# EAGLE schematic main_board-v2.1 (EAGLE 9.1.3)
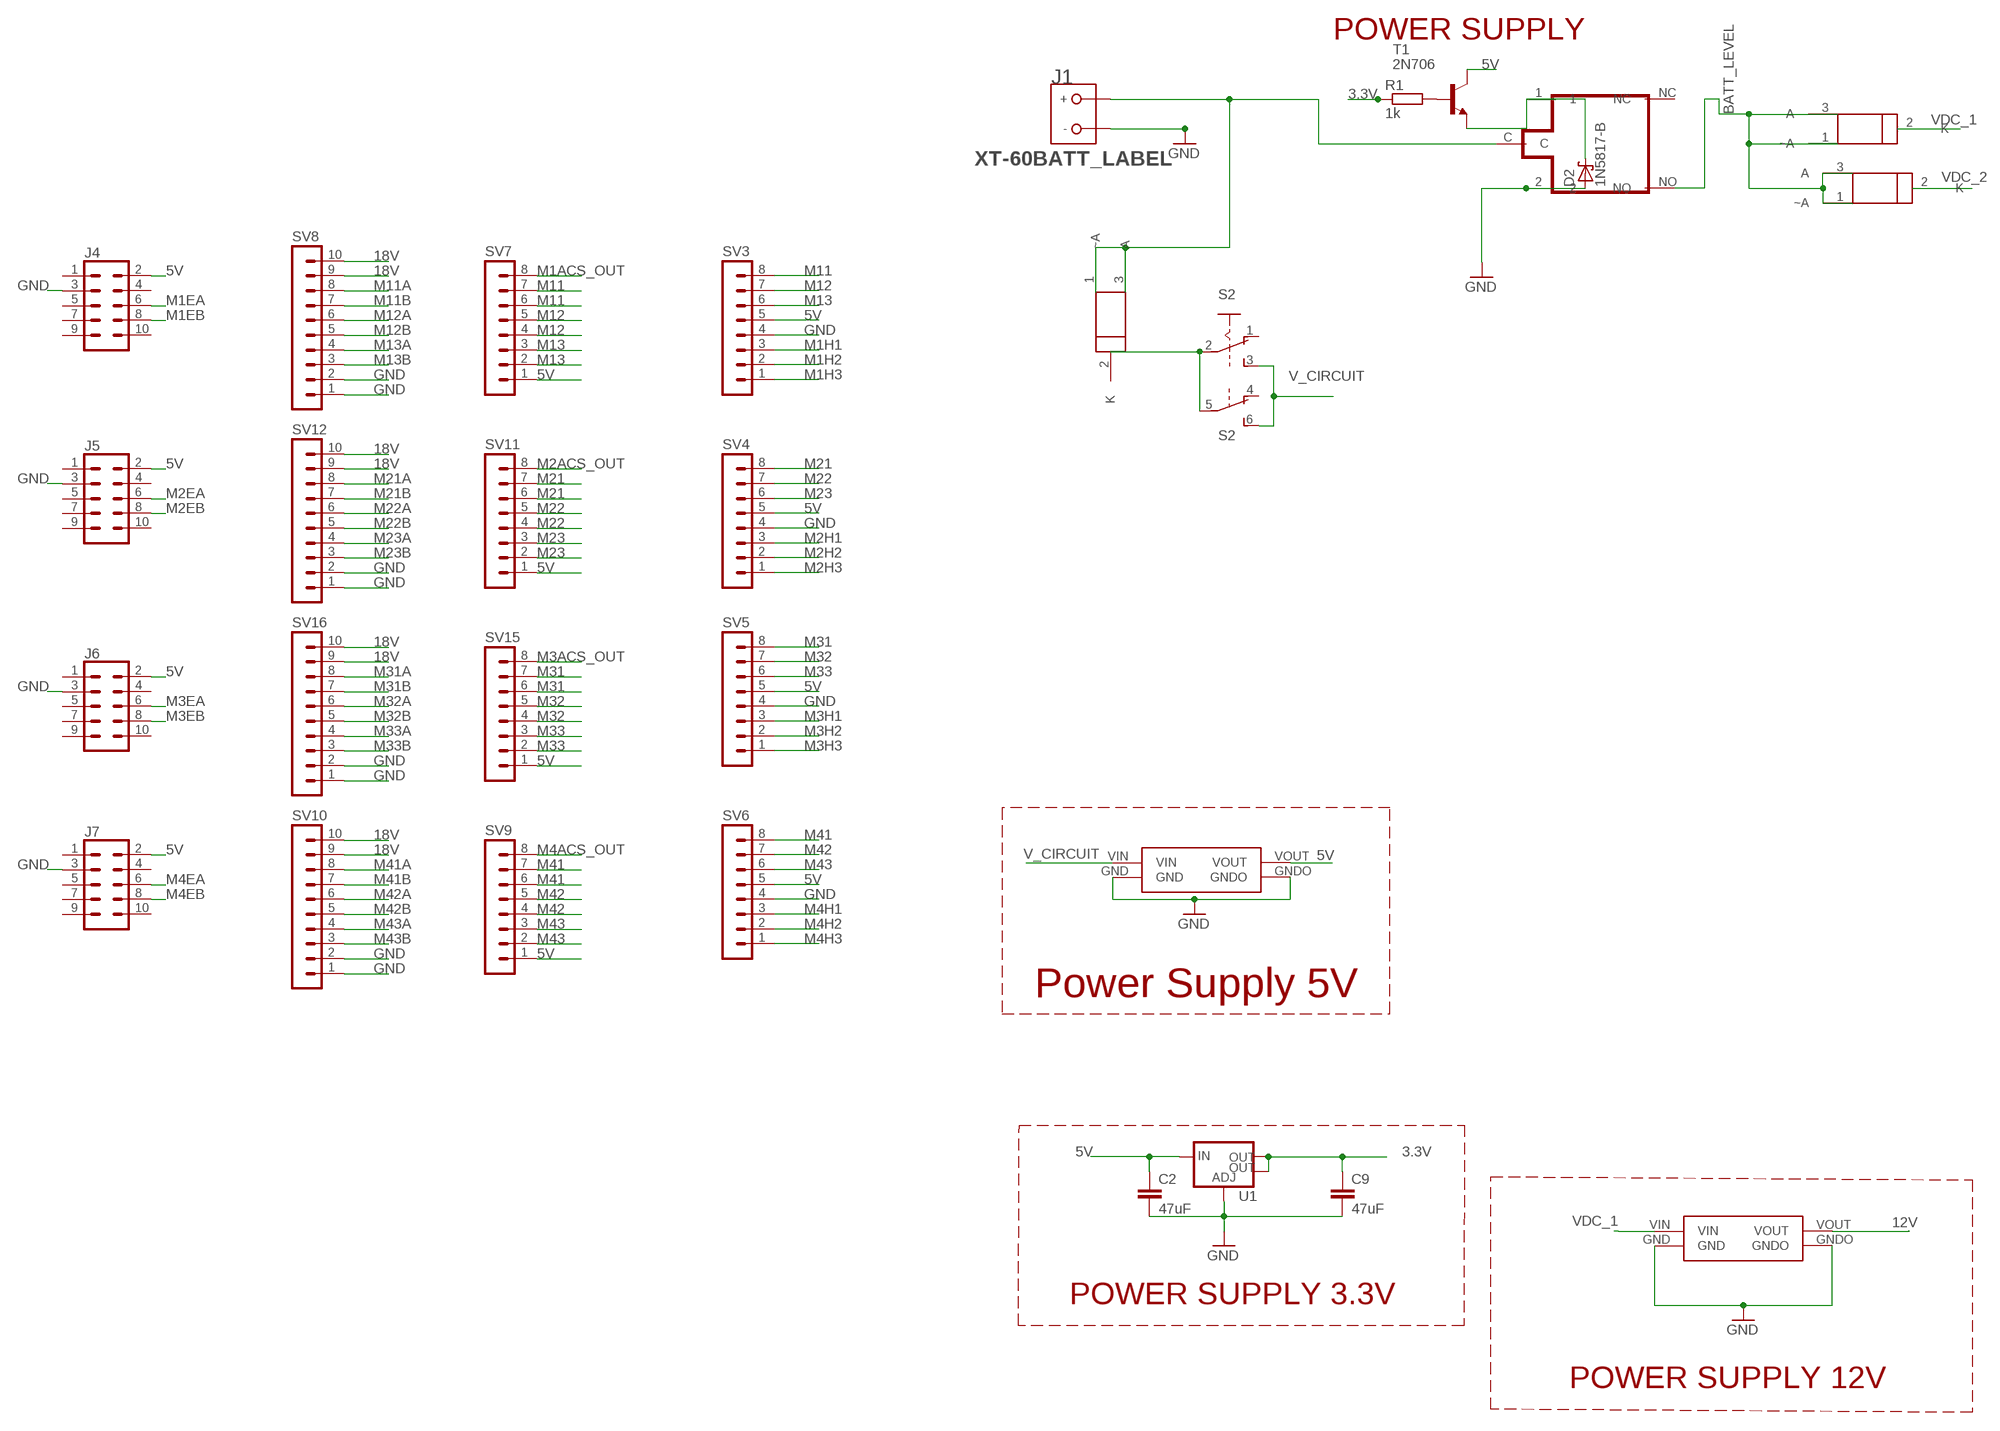
[diagram p0: schematic, sheet 1, part 1 of 2]
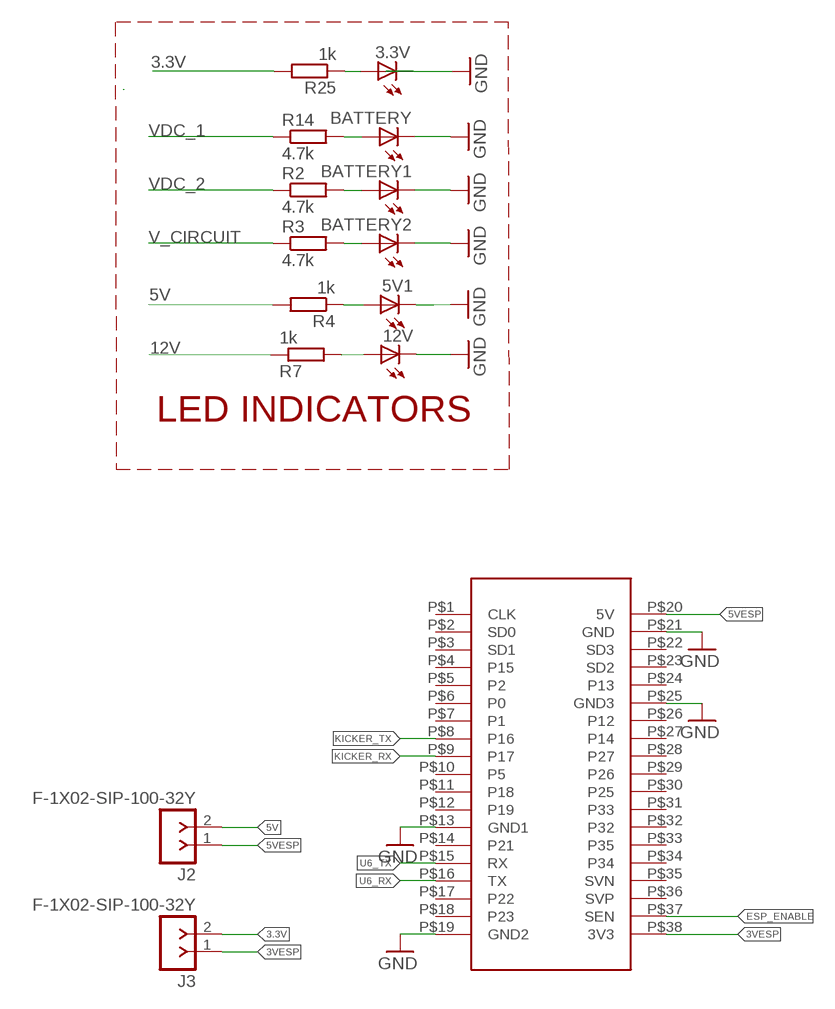
[diagram p1: schematic, sheet 1, part 2 of 2]

## Parts
3.3V  LEDCHIPLED_0805  [CHIPLED_0805]
5V1  LEDCHIPLED_0805  [CHIPLED_0805]
12V  LEDCHIPLED_0805  [CHIPLED_0805]
BATTERY  LEDCHIPLED_0805  [CHIPLED_0805]
BATTERY1  LEDCHIPLED_0805  [CHIPLED_0805]
BATTERY2  LEDCHIPLED_0805  [CHIPLED_0805]
C2  47uF  C-EUC1206  [C1206]
C9  47uF  C-EUC1206  [C1206]
D2  1N5817-B  [DO41-7.6]
J1  XT-60BATT_LABEL  [XT-60]
J2  F-1X02-SIP-100-32Y  [SIP-100-02-32Y]
J3  F-1X02-SIP-100-32Y  [SIP-100-02-32Y]
J4  CONN_05X2SHD_LOCK  [2X5-SHROUDED_LOCK]
J5  CONN_05X2SHD_LOCK  [2X5-SHROUDED_LOCK]
J6  CONN_05X2SHD_LOCK  [2X5-SHROUDED_LOCK]
J7  CONN_05X2SHD_LOCK  [2X5-SHROUDED_LOCK]
R1  1k  R-EU_R1206  [R1206]
R2  4.7k  R-EU_R1206  [R1206]
R3  4.7k  R-EU_R1206  [R1206]
R4  1k  R-EU_R1206  [R1206]
R7  1k  R-EU_R1206  [R1206]
R14  4.7k  R-EU_R1206  [R1206]
R25  1k  R-EU_R1206  [R1206]
S2  A68-A31  [A68-A31]
SV3  MA08-1  [MA08-1]
SV4  MA08-1  [MA08-1]
SV5  MA08-1  [MA08-1]
SV6  MA08-1  [MA08-1]
SV7  MA08-1  [MA08-1]
SV8  MA10-1  [MA10-1]
SV9  MA08-1  [MA08-1]
SV10  MA10-1  [MA10-1]
SV11  MA08-1  [MA08-1]
SV12  MA10-1  [MA10-1]
SV15  MA08-1  [MA08-1]
SV16  MA10-1  [MA10-1]
T1  2N706  [TO18]
U1  V_REG_LM1117SOT223  [SOT223]
U2  LP38690DT-3.3  [TO228P1042X238-3N]
U3  LP38690DT-3.3  [TO228P1042X238-3N]
U4  LP38690DT-3.3  [TO228P1042X238-3N]
U$2  REL  [REL]
U$3  BUCK  [BUCK]
U$4  BUCK  [BUCK]
U$6  NODEMCU32S  [NODEMCU32]

## Nets
3.3V: C9.1 J3.2 R1.1 R25.2 U1.2(OUT) U1.4(OUT)
3VESP: J3.1 U$6.P$38(3V3)
5V: C2.1 J2.2 J4.2 J5.2 J6.2 J7.2 R4.2 SV3.5 SV4.5 SV5.5 SV6.5 SV7.1 SV9.1 SV11.1 SV15.1 T1.3(C) U1.3(IN) U$3.VOUT
5VESP: J2.1 U$6.P$20(5V)
12V: R7.1 U$4.VOUT
18V [18V]: SV8.9 SV8.10 SV10.9 SV10.10 SV12.9 SV12.10 SV16.9 SV16.10
BATT_LEVEL: U2.1(~A) U2.3(A) U4.1(~A) U4.3(A) U$2.NO
ESP_ENABLE: U$6.P$37(SEN)
GND: 3.3V.C 5V1.C 12V.C BATTERY1.C BATTERY2.C BATTERY.C C2.2 C9.2 D2.A J1.GND(-) J4.3 J5.3 J6.3 J7.3 SV3.4 SV4.4 SV5.4 SV6.4 SV8.1 SV8.2 SV10.1 SV10.2 SV12.1 SV12.2 SV16.1 SV16.2 U1.1(ADJ) U$2.2 U$3.GND U$3.GNDO U$4.GND U$4.GNDO U$6.P$13(GND1) U$6.P$19(GND2) U$6.P$21(GND) U$6.P$25(GND3)
INPUT: J1.BATT(+) U3.1(~A) U3.3(A) U$2.C
KICKER_RX: U$6.P$9(P17)
KICKER_TX: U$6.P$8(P16)
M1ACS_OUT: SV7.8
M1EA: J4.6
M1EB: J4.8
M1H1: SV3.3
M1H2: SV3.2
M1H3: SV3.1
M2ACS_OUT: SV11.8
M2EA: J5.6
M2EB: J5.8
M2H1: SV4.3
M2H2: SV4.2
M2H3: SV4.1
M3ACS_OUT: SV15.8
M3EA: J6.6
M3EB: J6.8
M3H1: SV5.3
M3H2: SV5.2
M3H3: SV5.1
M4ACS_OUT: SV9.8
M4EA: J7.6
M4EB: J7.8
M4H1: SV6.3
M4H2: SV6.2
M4H3: SV6.1
M11: SV3.8 SV7.6 SV7.7
M11A [signal]: SV8.8
M11B [signal]: SV8.7
M12: SV3.7 SV7.4 SV7.5
M12A: SV8.6
M12B: SV8.5
M13: SV3.6 SV7.2 SV7.3
M13A: SV8.4
M13B: SV8.3
M21: SV4.8 SV11.6 SV11.7
M21A: SV12.8
M21B: SV12.7
M22: SV4.7 SV11.4 SV11.5
M22A: SV12.6
M22B: SV12.5
M23: SV4.6 SV11.2 SV11.3
M23A: SV12.4
M23B: SV12.3
M31 [motor]: SV5.8 SV15.6 SV15.7
M31A: SV16.8
M31B: SV16.7
M32 [motor]: SV5.7 SV15.4 SV15.5
M32A: SV16.6
M32B: SV16.5
M33 [motor]: SV5.6 SV15.2 SV15.3
M33A: SV16.4
M33B: SV16.3
M41: SV6.8 SV9.6 SV9.7
M41A: SV10.8
M41B: SV10.7
M42: SV6.7 SV9.4 SV9.5
M42A: SV10.6
M42B: SV10.5
M43: SV6.6 SV9.2 SV9.3
M43A: SV10.4
M43B: SV10.3
N$1: BATTERY1.A R2.2
N$2: BATTERY2.A R3.2
N$3: 5V1.A R4.1
N$14: 12V.A R7.2
N$18: BATTERY.A R14.2
N$19: 3.3V.A R25.1
N$21: R1.2 T1.2(B)
N$22: D2.C T1.1(E) U$2.1
N$25: S2.2(A:P) S2.5(B:P) U3.2(K)
U6_RX: U$6.P$16(TX)
U6_TX: U$6.P$15(RX)
V_CIRCUIT: R3.1 S2.3(A:S) S2.6(B:S) U$3.VIN
VDC_1: R14.1 U4.2(K) U$4.VIN
VDC_2: R2.1 U2.2(K)
Unconnected: J4.1 J4.4 J4.5 J4.7 J4.9 J4.10 J5.1 J5.4 J5.5 J5.7 J5.9 J5.10 J6.1 J6.4 J6.5 J6.7 J6.9 J6.10 J7.1 J7.4 J7.5 J7.7 J7.9 J7.10 S2.1(A:O) S2.4(B:O) U$2.NC U$6.P$1(CLK) U$6.P$2(SD0) U$6.P$3(SD1) U$6.P$4(P15) U$6.P$5(P2) U$6.P$6(P0) U$6.P$7(P1) U$6.P$10(P5) U$6.P$11(P18) U$6.P$12(P19) U$6.P$14(P21) U$6.P$17(P22) U$6.P$18(P23) U$6.P$22(SD3) U$6.P$23(SD2) U$6.P$24(P13) U$6.P$26(P12) U$6.P$27(P14) U$6.P$28(P27) U$6.P$29(P26) U$6.P$30(P25) U$6.P$31(P33) U$6.P$32(P32) U$6.P$33(P35) U$6.P$34(P34) U$6.P$35(SVN) U$6.P$36(SVP)

## Notes on the sheet
- POWER SUPPLY
- LED INDICATORS
- Power Supply 5V
- POWER SUPPLY 3.3V
- POWER SUPPLY 12V

## Library data of the parts
3.3V 5V1 12V BATTERY BATTERY1 BATTERY2 = led:LED: LED OSRAM: - CHIPLED LG R971, LG N971, LY N971, LG Q971, LY Q971, LO R971, LY R971 LH N974, LH R974 LS Q976, LO Q976, LY Q976 LO Q996 - Hyper CHIPLED LW Q18S LB Q993, LB Q99A, LB R99A - SideLED LS A670, LO A670, LY A670, LG A670, LP A670 LB A673, LV A673, LT A673, LW A673 LH A674 LY A675 LS A676, LA A676, LO A676, LY A676, LW A676 LS A679, LY A679, LG A679 - Hyper Micro SIDELED® LS Y876, LA Y876, LO Y876, LY Y876 LT Y87S - SmartLED LW L88C, LW L88S LB L89C, LB L89S, LG L890 LS L89K, LO L89K, LY L89K LS L896, LA L896, LO L896, LY L896 - TOPLED LS T670, LO T670, LY T670, LG T670, LP T670 LSG T670, LSP T670, LSY T670, LOP T670, LYG T670 LG T671, LOG T671, LSG T671 LB T673, LV T673, LT T673, LW T673 LH T674 LS T676, LA T676, LO T676, LY T676, LB T676, LH T676, LSB T676, LW T676 LB T67C, LV T67C, LT T67C, LS T67K, LO T67K, LY T67K, LW E67C LS E67B, LA E67B, LO E67B, LY E67B, LB E67C, LV E67C, LT E67C LW T67C LS T679, LY T679, LG T679 LS T770, LO T770, LY T770, LG T770, LP T770 LB T773, LV T773, LT T773, LW T773 LH T774 LS E675, LA E675, LY E675, LS T675 LS T776, LA T776, LO T776, LY T776, LB T776 LHGB T686 LT T68C, LB T68C - Hyper Mini TOPLED® LB M676 - Mini TOPLED Santana® LG M470 LS M47K, LO M47K, LY M47K Source: http://www.osram.convergy.de LUXEON: - LUMILED® LXK2-PW12-R00, LXK2-PW12-S00, LXK2-PW14-U00, LXK2-PW14-V00 LXK2-PM12-R00, LXK2-PM12-S00, LXK2-PM14-U00 LXK2-PE12-Q00, LXK2-PE12-R00, LXK2-PE12-S00, LXK2-PE14-T00, LXK2-PE14-U00 LXK2-PB12-K00, LXK2-PB12-L00, LXK2-PB12-M00, LXK2-PB14-N00, LXK2-PB14-P00, LXK2-PB14-Q00 LXK2-PR12-L00, LXK2-PR12-M00, LXK2-PR14-Q00, LXK2-PR14-R00 LXK2-PD12-Q00, LXK2-PD12-R00, LXK2-PD12-S00 LXK2-PH12-R00, LXK2-PH12-S00 LXK2-PL12-P00, LXK2-PL12-Q00, LXK2-PL12-R00 Source: www.luxeon.com KINGBRIGHT: KA-3528ASYC Source: www.kingbright.com
C2 C9 = rcl:C-EU: CAPACITOR, European symbol
D2 = diode:1N581*: 1.0A SCHOTTKY BARRIER RECTIFIER Source: http://www.diodes.com/datasheets/ds23001.pdf
J1 = RoboJackets-Connectors:XT-60: XT-60 Power Connector Distributor: HobbyKing <http://www.hobbyking.com/hobbyking/store/RC_PRODUCT_SEARCH.asp?strSearch=xt-60>
J2 J3 = con-headers-jp:F-1X02-: FEMALE HEADER
J4-J7 = SparkFun-Connectors:CONN_05X2: Multi connection point. Often used as Generic Header-pin footprint for 0.1 inch spaced/style header connections For AVR SPI programming port, see special device with nice symbol: "AVR_SPI_PROG_5x2.dev" You can populate with any combo of single row headers, but if you'd like an exact match, check these: 2x5 AVR ICSP Male Header <https://www.sparkfun.com/products/778> (PRT-00778) 2x5 Pin Shrouded Header <https://www.sparkfun.com/products/8506> (PRT-08506) On any of the 0.1 inch spaced packages, you can populate with these: Break Away Headers - Straight <https://www.sparkfun.com/products/116> (PRT-00116) Break Away Male Headers - Right Angle <https://www.sparkfun.com/products/553> (PRT-00553) Female Headers <https://www.sparkfun.com/products/115> (PRT-00115) Break Away Headers - Machine Pin <https://www.sparkfun.com/products/117> (PRT-00117) Break Away Female Headers - Swiss Machine Pin <https://www.sparkfun.com/products/743> (PRT-00743) Special note: the shrouded connector mates well with our 5x2 ribbon cables: 2x5 Pin IDC Ribbon Cable <https://www.sparkfun.com/products/8535> (PRT-08535); PROD_ID: CONN-08671; SF_ID: PRT-08506
R1-R4 R7 R14 R25 = resistor:R-EU_: RESISTOR, European symbol
S2 = switch:A68-A31: SLIDING SWITCH Siemens, distributor Buerklin, 11G766
SV3-SV7 SV9 SV11 SV15 = con-lstb:MA08-1: PIN HEADER; OC_FARNELL: unknown; OC_NEWARK: unknown
SV8 SV10 SV12 SV16 = con-lstb:MA10-1: PIN HEADER; OC_FARNELL: unknown; OC_NEWARK: unknown
T1 = transistor:2N706: NPN TRANSISTOR
U1 = SparkFun-PowerIC:V_REG_LM1117: Voltage Regulator LM1117 Standard adjustable voltage regulator but in SMD form. Spark Fun Electronics SKU : COM-00595; PROD_ID: VREG-08170
U2-U4 = LP38690DT-3.3:LP38690DT-3.3; MPN: LP38690DT-3.3; OC_FARNELL: 1008048; OC_NEWARK: 41K7439; PACKAGE: TO-252; SUPPLIER: National Semiconductor
U$2 = rel:REL
U$3 U$4 = BUCK:BUCK
U$6 = nodeMCU:NODEMCU32S

## Net classes
1 5v: width 0.4 mm, drill 0.4 mm, clearance 0.2 mm
2 18V: width 1.2 mm, drill 1.3 mm, clearance 0.2 mm
3 signal: width 0.3 mm, drill 0.4 mm, clearance 0.2 mm
4 gnd: width 0.3 mm, drill 0.4 mm, clearance 0.2 mm
6 motor: width 0.8 mm, drill 1 mm, clearance 0.2 mm